# Altium schematic sheet AC-DC-Supply-M1.SchDoc: AC-DC-Supply-M1
size 282 x 208 mm; Date: 9/8/2021 9:38:47 AM; SheetNumber: 1; GateName_1: G$1; SymbolName_1: A4L-LOC; LibraryName: frames; DeviceSetName: A4L-LOC; Sheet: Sheet:
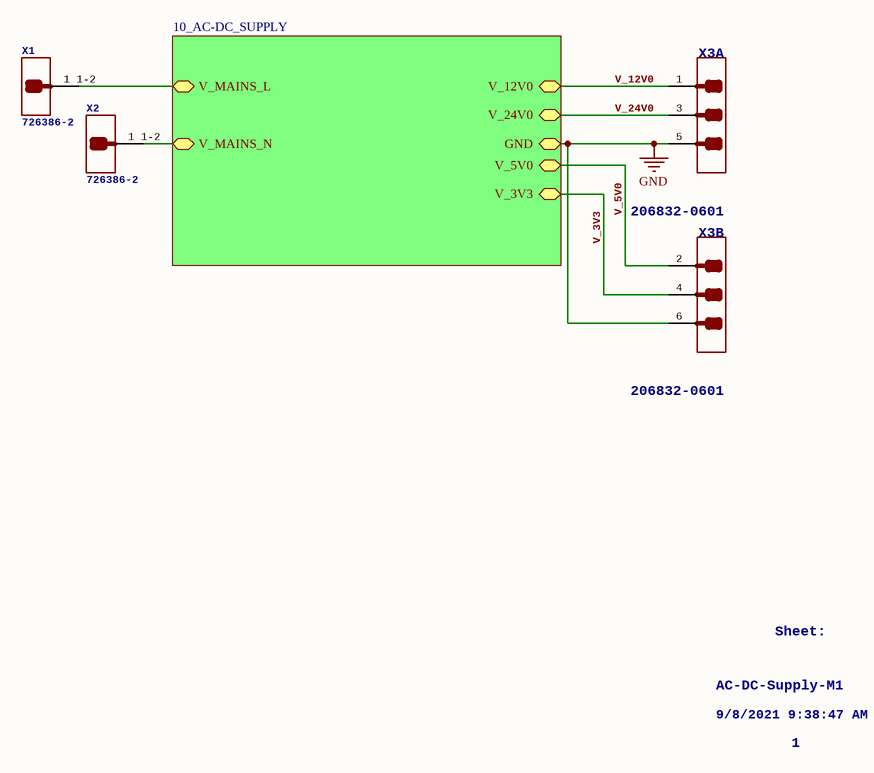
[diagram p0: AC-DC-Supply-M1.SchDoc]

## Parts
X1  726386-2  [TE_726386-2_MODIFIED]
X2  726386-2  [TE_726386-2_MODIFIED]
X3  MOLEX_206832-0601MOLEX_206832-0601  [MOLEX_206832-0601]  (value not drawn)  (parts A,B of 2)

## Sub-sheets
10_AC-DC_SUPPLY = AC-DC_SUPPLY.SchDoc: V_MAINS_L (bidir), V_MAINS_N (bidir), V_24V0 (bidir), V_12V0 (bidir), V_5V0 (bidir), V_3V3 (bidir), GND (bidir)

## Nets
GND: X3.5 X3.6 ; sheet 10_AC-DC_SUPPLY/GND
V_3V3: X3.4 ; sheet 10_AC-DC_SUPPLY/V_3V3
V_5V0: X3.2 ; sheet 10_AC-DC_SUPPLY/V_5V0
V_12V0: X3.1 ; sheet 10_AC-DC_SUPPLY/V_12V0
V_24V0: X3.3 ; sheet 10_AC-DC_SUPPLY/V_24V0
NetX1_1 1-2: X1.1_1-2 ; sheet 10_AC-DC_SUPPLY/V_MAINS_L
NetX2_1 1-2: X2.1_1-2 ; sheet 10_AC-DC_SUPPLY/V_MAINS_N

## Notes on the sheet
- Sheet:
- AC-DC-Supply-M1
- 9/8/2021 9:38:47 AM
- 1
- 2
- 3
- 4
- 5
- 6
- A
- B
- C
- D

## Library data of the parts
X1 X2 = 726386-2: Terminals, Faston, GDS-Flachstecker 6.3x0.8mm, TE; MFR: TE Connectivity; PART_VALUE: 6.35mmx8mm; GateName_1: G$0; DESCRIPTION: 0.250" (6.35mm) Quick Connect Male - Solder Connector Non-Insulated; SymbolName_1: 726386-2; LibraryName: Labops_Lib_AH; DeviceSetName: 726386-2; MFN: 726386-2; PRICE-1: 0.24; SUPPLIER-1: Digikey
X3 = MOLEX_206832-0601MOLEX_206832-0601: Connector Header Through Hole 6 position 0.118" (3.00mm); MFR: Molex; PART_VALUE: 6CCT x 2Row; GateName_1: A; SymbolName_1: MOLEX_206832-0601_0_0; GateName_2: B; SymbolName_2: MOLEX_206832-0601_0_1; DESCRIPTION: Connector Header Through Hole 6 position 3mm Microfit; LIB_STATUS: Prototype; OUR_STOCK: 20; DeviceName: MOLEX_206832-0601; LibraryName: Labops_Lib_AH; DeviceSetName: MOLEX_206832-0601; 206832-0601: 206832-0601; MFN: 206832-0601; PRICE-1: 1.32; SUPPLIER-1: Digikey